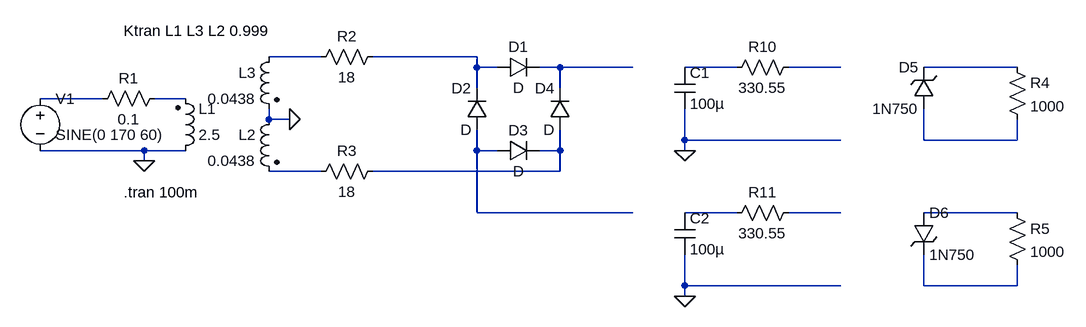
[diagram p0: schematic Phone_power_supply.asc]
Phone_power_supply.asc, the LTspice schematic file:
Version 4
SHEET 1 996 680
WIRE -160 -464 -240 -464
WIRE 80 -464 -80 -464
WIRE 80 -448 80 -464
WIRE 112 -448 80 -448
WIRE 208 -448 176 -448
WIRE 320 -448 208 -448
WIRE 480 -448 400 -448
WIRE 640 -448 560 -448
WIRE 912 -448 768 -448
WIRE 80 -416 80 -448
WIRE 208 -416 208 -448
WIRE -496 -400 -592 -400
WIRE -368 -400 -416 -400
WIRE -240 -368 -240 -384
WIRE -208 -368 -240 -368
WIRE 400 -336 400 -384
WIRE 640 -336 400 -336
WIRE 768 -336 768 -384
WIRE 912 -336 912 -368
WIRE 912 -336 768 -336
WIRE -432 -320 -592 -320
WIRE -368 -320 -432 -320
WIRE 80 -320 80 -352
WIRE 112 -320 80 -320
WIRE 208 -320 208 -352
WIRE 208 -320 176 -320
WIRE 400 -320 400 -336
WIRE -432 -304 -432 -320
WIRE -160 -288 -240 -288
WIRE 208 -288 208 -320
WIRE 208 -288 -80 -288
WIRE 80 -224 80 -320
WIRE 320 -224 80 -224
WIRE 480 -224 400 -224
WIRE 640 -224 560 -224
WIRE 912 -224 768 -224
WIRE 400 -112 400 -160
WIRE 640 -112 400 -112
WIRE 768 -112 768 -160
WIRE 912 -112 912 -144
WIRE 912 -112 768 -112
WIRE 400 -96 400 -112
FLAG -432 -304 0
FLAG -208 -368 0
FLAG 400 -320 0
FLAG 400 -96 0
DATAFLAG -432 -304 ""
SYMBOL voltage -592 -416 R0
WINDOW 123 24 44 Left 2
WINDOW 39 0 0 Left 0
WINDOW 3 24 72 Left 2
SYMATTR Value SINE(0 170 60)
SYMATTR InstName V1
SYMBOL res -400 -416 R90
WINDOW 0 0 56 VBottom 2
WINDOW 3 32 56 VTop 2
SYMATTR InstName R1
SYMATTR Value 0.1
SYMBOL ind2 -384 -304 M180
WINDOW 0 36 80 Left 2
WINDOW 3 36 40 Left 2
SYMATTR InstName L1
SYMATTR Value 2.5
SYMATTR Type ind
SYMBOL res -64 -480 R90
WINDOW 0 0 56 VBottom 2
WINDOW 3 32 56 VTop 2
SYMATTR InstName R2
SYMATTR Value 18
SYMBOL res -64 -304 R90
WINDOW 0 0 56 VBottom 2
WINDOW 3 32 56 VTop 2
SYMATTR InstName R3
SYMATTR Value 18
SYMBOL ind2 -224 -384 M0
SYMATTR InstName L2
SYMATTR Value 0.0438
SYMATTR Type ind
SYMBOL ind2 -224 -480 M0
SYMATTR InstName L3
SYMATTR Value 0.0438
SYMATTR Type ind
SYMBOL diode 112 -432 R270
WINDOW 0 32 32 VTop 2
WINDOW 3 0 32 VBottom 2
SYMATTR InstName D1
SYMBOL diode 96 -352 R180
WINDOW 0 24 64 Left 2
WINDOW 3 24 0 Left 2
SYMATTR InstName D2
SYMBOL diode 112 -304 R270
WINDOW 0 32 32 VTop 2
WINDOW 3 0 32 VBottom 2
SYMATTR InstName D3
SYMBOL diode 224 -352 R180
WINDOW 0 24 64 Left 2
WINDOW 3 24 0 Left 2
SYMATTR InstName D4
SYMBOL cap 384 -448 R0
SYMATTR InstName C1
SYMATTR Value 100µ
SYMBOL cap 384 -224 R0
SYMATTR InstName C2
SYMATTR Value 100µ
SYMBOL res 896 -464 R0
SYMATTR InstName R4
SYMATTR Value 1000
SYMBOL res 896 -240 R0
SYMATTR InstName R5
SYMATTR Value 1000
SYMBOL zener 784 -384 R180
WINDOW 0 24 64 Left 2
WINDOW 3 24 0 Left 2
SYMATTR InstName D5
SYMATTR Value 1N750
SYMBOL zener 752 -224 R0
SYMATTR InstName D6
SYMATTR Value 1N750
SYMBOL res 576 -464 R90
WINDOW 0 0 56 VBottom 2
WINDOW 3 32 56 VTop 2
SYMATTR InstName R10
SYMATTR Value 330.55
SYMBOL res 576 -240 R90
WINDOW 0 0 56 VBottom 2
WINDOW 3 32 56 VTop 2
SYMATTR InstName R11
SYMATTR Value 330.55
TEXT -464 -504 Left 2 !Ktran L1 L3 L2 0.999
TEXT -464 -256 Left 2 !.tran 100m

The netlist it stands for:
* Phone_power_supply.asc
V1 N007 0 SINE(0 170 60)
R1 N008 N007 0.1
L1 0 N008 2.5
R2 N002 N001 18
R3 N011 N012 18
L2 0 N012 0.0438
L3 N001 0 0.0438
D1 N002 N003 D
D2 N010 N002 D
D3 N010 N011 D
D4 N011 N003 D
C1 N004 0 100µ
C2 N013 0 100µ
R4 N006 N009 1000
R5 N015 N016 1000
D5 N009 N006 1N750
D6 N015 N016 1N750
R10 N005 N004 330.55
R11 N014 N013 330.55
.model D D
.lib standard.dio
Ktran L1 L3 L2 0.999
.tran 100m
.backanno
.end